# EAGLE design module-pam8320 (EAGLE 7.7.0)
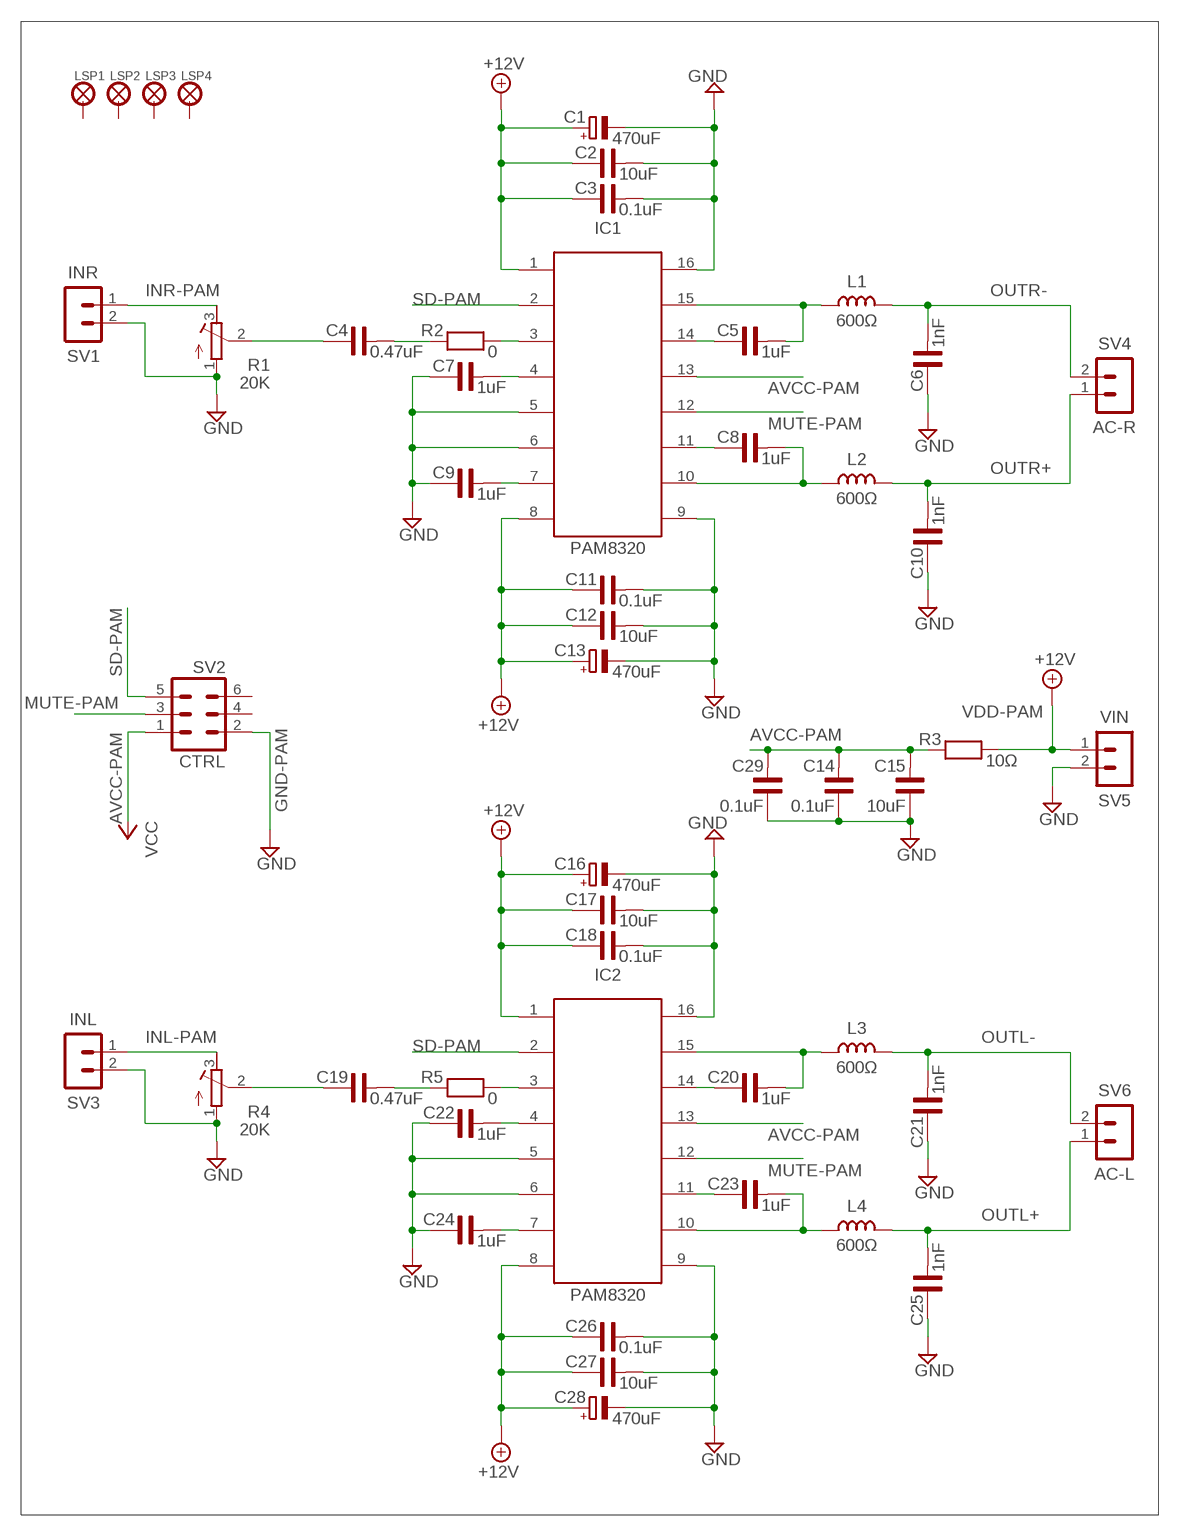
[diagram p0: schematic, sheet 1]

## Parts
C1  470uF  CPOL-EUE5-10.5  [E5-10,5]
C2  10uF  C-US1206  [C1206]
C3  0.1uF  C-US0805  [C0805]
C4  0.47uF  C-US0805  [C0805]
C5  1uF  C-US1206  [C1206]
C6  1nF  C-US0805  [C0805]
C7  1uF  C-US1206  [C1206]
C8  1uF  C-US1206  [C1206]
C9  1uF  C-US1206  [C1206]
C10  1nF  C-US0805  [C0805]
C11  0.1uF  C-US0805  [C0805]
C12  10uF  C-US1206  [C1206]
C13  470uF  CPOL-EUE5-10.5  [E5-10,5]
C14  0.1uF  C-US0805  [C0805]
C15  10uF  C-US1206  [C1206]
C16  470uF  CPOL-EUE5-10.5  [E5-10,5]
C17  10uF  C-US1206  [C1206]
C18  0.1uF  C-US0805  [C0805]
C19  0.47uF  C-US0805  [C0805]
C20  1uF  C-US1206  [C1206]
C21  1nF  C-US0805  [C0805]
C22  1uF  C-US1206  [C1206]
C23  1uF  C-US1206  [C1206]
C24  1uF  C-US1206  [C1206]
C25  1nF  C-US0805  [C0805]
C26  0.1uF  C-US0805  [C0805]
C27  10uF  C-US1206  [C1206]
C28  470uF  CPOL-EUE5-10.5  [E5-10,5]
C29  0.1uF  C-US0805  [C0805]
IC1  PAM8320  [SO16]
IC2  PAM8320  [SO16]
L1  600Ω  L-USL1206  [L1206]
L2  600Ω  L-USL1206  [L1206]
L3  600Ω  L-USL1206  [L1206]
L4  600Ω  L-USL1206  [L1206]
LSP1  LSP27  [LSP27]
LSP2  LSP27  [LSP27]
LSP3  LSP27  [LSP27]
LSP4  LSP27  [LSP27]
R1  20K  PV32H  [PV32H]
R2  0  R-US0805  [R0805]
R3  10Ω  R-US0805  [R0805]
R4  20K  PV32H  [PV32H]
R5  0  R-US0805  [R0805]
SV1  INR  MA02-1GREEN  [MA02-1-GREEN]
SV2  CTRL  MA03-2PL  [MA03-2]
SV3  INL  MA02-1GREEN  [MA02-1-GREEN]
SV4  AC-R  MA02-1GREEN  [MA02-1-GREEN]
SV5  VIN  MA02-1GREEN  [MA02-1-GREEN]
SV6  AC-L  MA02-1GREEN  [MA02-1-GREEN]

## Nets
AVCC-PAM: C14.2 C15.2 C29.2 IC1.13 IC2.13 R3.1 SV2.1 ; supply symbol labelled VCC
GND-PAM: C1.- C2.2 C3.2 C6.1 C7.1 C9.1 C10.1 C11.2 C12.2 C13.- C14.1 C15.1 C16.- C17.2 C18.2 C21.1 C22.1 C24.1 C25.1 C26.2 C27.2 C28.- C29.1 IC1.5 IC1.6 IC1.9 IC1.16 IC2.5 IC2.6 IC2.9 IC2.16 R1.1 R4.1 SV1.2 SV2.2 SV3.2 SV5.2 ; supply symbol labelled GND
INL-PAM: R4.3 SV3.1
INR-PAM: R1.3 SV1.1
MUTE-PAM: IC1.12 IC2.12 SV2.3
N$1: IC1.3 R2.2
N$2: C4.1 R1.2
N$3: C22.2 IC2.4
N$4: C4.2 R2.1
N$5: C24.2 IC2.7
N$6: C5.1 IC1.14
N$7: C7.2 IC1.4
N$8: C9.2 IC1.7
N$9: C5.2 IC1.15 L1.1
N$10: C8.1 IC1.11
N$11: C8.2 IC1.10 L2.1
N$13: C19.1 R4.2
N$24: IC2.3 R5.2
N$25: C19.2 R5.1
N$26: C20.1 IC2.14
N$28: C20.2 IC2.15 L3.1
N$29: C23.1 IC2.11
N$31: C23.2 IC2.10 L4.1
OUTL+: C25.2 L4.2 SV6.1
OUTL-: C21.2 L3.2 SV6.2
OUTR+: C10.2 L2.2 SV4.1
OUTR-: C6.2 L1.2 SV4.2
SD-PAM: IC1.2 IC2.2 SV2.5
VDD-PAM: C1.+ C2.1 C3.1 C11.1 C12.1 C13.+ C16.+ C17.1 C18.1 C26.1 C27.1 C28.+ IC1.1 IC1.8 IC2.1 IC2.8 R3.2 SV5.1 ; supply symbol labelled +12V
Unconnected: LSP1.MP LSP2.MP LSP3.MP LSP4.MP SV2.4 SV2.6

## Library data of the parts
C1 C13 C16 C28 = rcl:CPOL-EU: POLARIZED CAPACITOR, European symbol
C2 C5 C7-C9 C12 C15 C17 C20 C22-C24 C27 = MyComponents:C-US: SMD Multilayer Ceramic Capacitor
C3 C4 C6 C10 C11 C14 C18 C19 C21 C25 C26 C29 = MyComponents:C-US: SMD Multilayer Ceramic Capacitor; MOUSER: 80-C0805C104J5RAUTO
IC1 IC2 = MyComponents:PAM8320: PAM8320 20W Mono Class D Audio Amplifier
L1-L4 = MyComponents:L-US: SMD Ferrite Bead
LSP1-LSP4 = MyComponents:LSP27: Solder Pad, drill 2.75 mm
R1 R4 = MyComponents:PV32H: BOURNS Trimmer Potentiometers Lead Sealed Type Single-turn PV32 Series
R2 R3 R5 = MyComponents:R-US: SMD Resistor; MOUSER: 660-RK73H2ATTDD1R00F
SV1 SV3-SV6 = MyComponents:MA02-1: Headers & Wire Housing, 1 Row, 3 Position
SV2 = MyComponents:MA03-2: Headers & Wire Housing, 2 Row, 6 Position

## Board
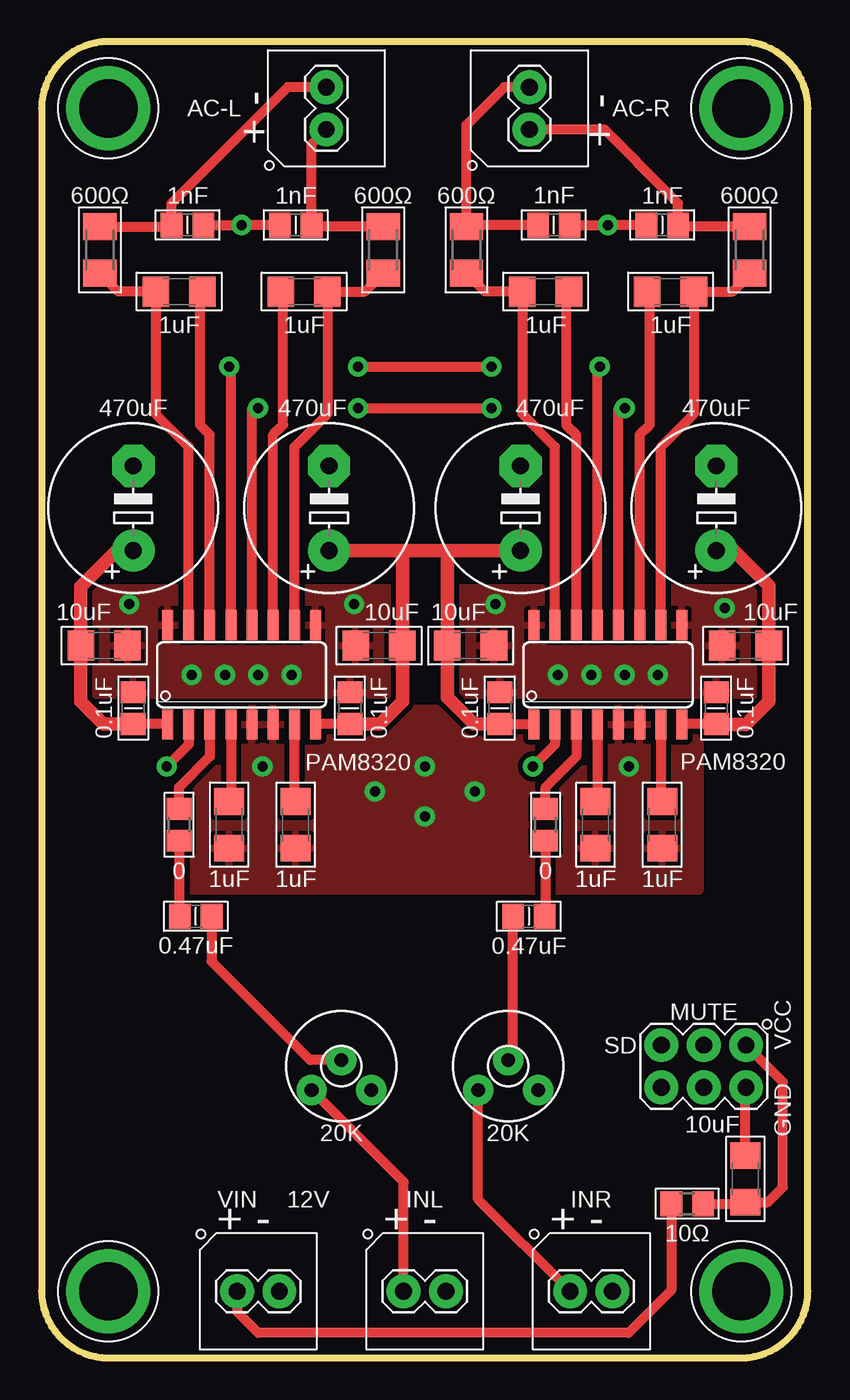
[diagram p1: board, top side]
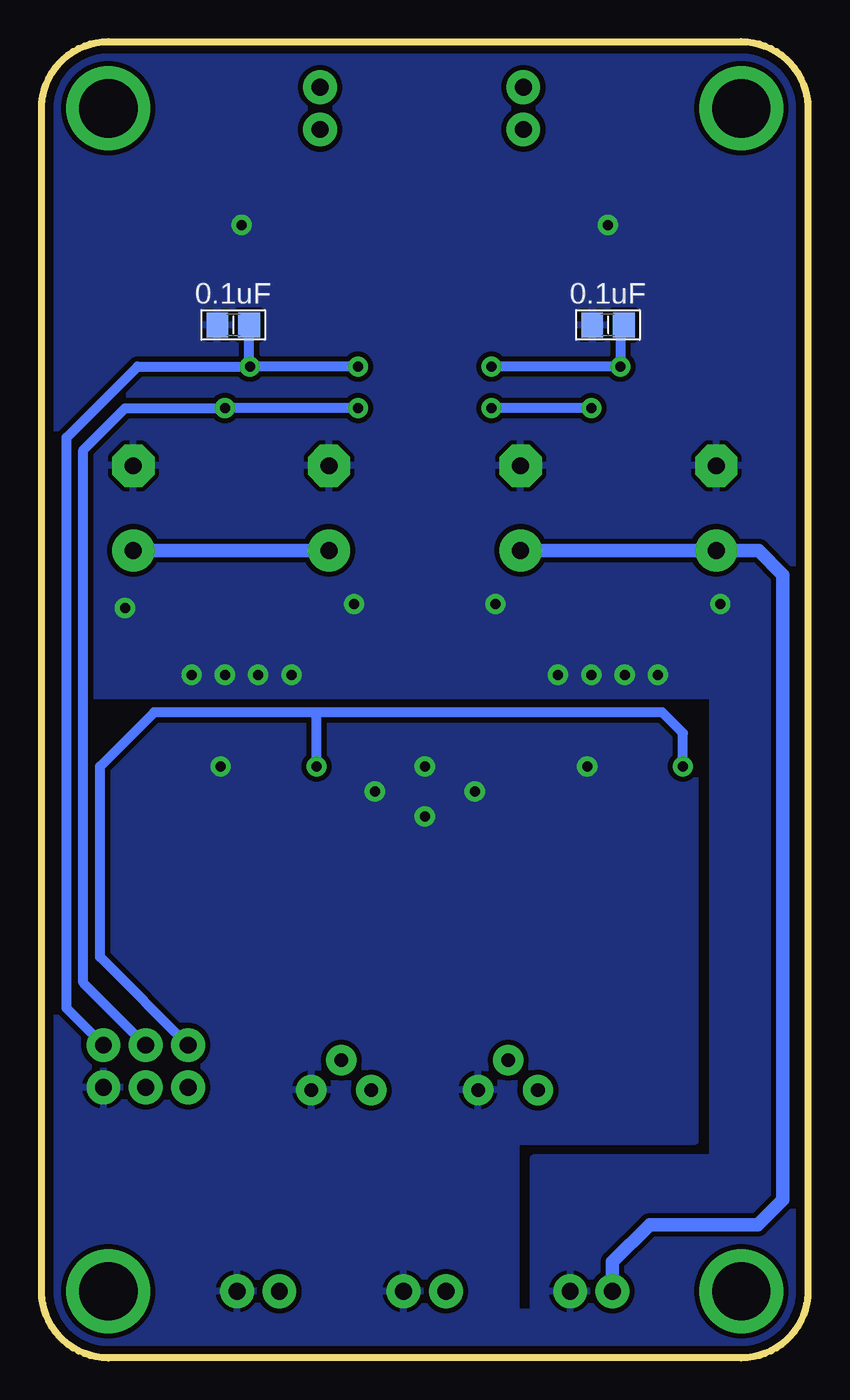
[diagram p2: board, bottom side, seen from below]

Size 46 x 79 mm. Coordinates in mm from the lower left corner, seen from the top.
Outline: 0,4 arc90 4,0 42,0 arc90 46,4 46,75 arc90 42,79 4,79 arc90 0,75 0,4
Copper layers (1*16): Top 0.035mm / dielectric 1.5mm / Bottom 0.035mm
Design rules "analog": minimum track width 15mil, minimum drill 19mil, track to track 12mil, track to pad 12mil, pad to pad 12mil, via to via 12mil, smd to smd 8mil, copper to edge 20mil, drill to drill 40mil, minimum pad ring 20mil, minimum via ring 12mil, stop-mask expansion 1mil, vias tented up to drill 0mil, thermal gap 10mil

### Footprints (pad centres in the part's own frame; a part is rotated, then mirrored left to right if it is on the bottom)
E5-10,5 = drill 1.016 pad 2.54: + -2.54,0 | drill 1.016 pad 2.54 octagon: - 2.54,0
C1206 = smd 1.6 x 1.8: 1 -1.4,0; 2 1.4,0
C0805 = smd 1.3 x 1.5: 1 -0.95,0; 2 0.95,0
SO16 = smd 0.66 x 1.8: 1 -4.445,-2.973; 2 -3.175,-2.973; 3 -1.905,-2.973; 4 -0.635,-2.973; 5 0.635,-2.973; 6 1.905,-2.973; 7 3.175,-2.973; 8 4.445,-2.973; 9 4.445,2.973; 10 3.175,2.973; 11 1.905,2.973; 12 0.635,2.973; 13 -0.635,2.973; 14 -1.905,2.973; 15 -3.175,2.973; 16 -4.445,2.973
L1206 = smd 1.6 x 2: 1 -1.4,0; 2 1.4,0
LSP27 = drill 3.5 pad 5: MP 0,0
PV32H = drill 0.813: 1 1.798,-1.422; 2 0,0.374; 3 -1.794,-1.422
R0805 = smd 1.3 x 1.5: 1 -0.95,0; 2 0.95,0
MA02-1-GREEN = drill 1.016: 1 -1.27,0; 2 1.27,0
MA03-2 = drill 1.016: 1 -2.54,-1.27; 2 -2.54,1.27; 3 0,-1.27; 4 0,1.27; 5 2.54,-1.27; 6 2.54,1.27

### Placement (x,y rotation side)
C1  28.75,51 90 top
C2  42.25,42.75 180 top
C3  18.5,39 90 top
C4  29.25,26.5 0 top
C5  30.25,64 180 top
C6  30.75,68 180 top
C7  33.25,32 90 top
C8  37.75,64 0 top
C9  37.25,32 90 top
C10  37.25,68 0 top
C11  5.5,39 90 top
C12  20.25,42.75 180 top
C13  40.5,51 90 top
C14  12,62 0 bottom
C15  42.25,10.75 270 top
C16  5.5,51 90 top
C17  3.75,42.75 0 top
C18  27.5,39 90 top
C19  9.25,26.5 180 top
C20  8.25,64 180 top
C21  8.75,68 180 top
C22  11.25,32 90 top
C23  15.75,64 0 top
C24  15.25,32 90 top
C25  15.25,68 0 top
C26  40.5,39 90 top
C27  25.75,42.75 0 top
C28  17.25,51 90 top
C29  34.5,62 0 bottom
IC1  34,41 0 top
IC2  12,41 0 top
L1  25.5,66.5 90 top
L2  42.5,66.5 90 top
L3  3.5,66.5 90 top
L4  20.5,66.5 90 top
LSP1  4,75 0 top
LSP2  42,75 0 top
LSP3  42,4 0 top
LSP4  4,4 0 top
R1  28,17.5 0 top
R2  30.25,32 90 top
R3  38.75,9.25 180 top
R4  18,17.5 0 top
R5  8.25,32 90 top
SV1  33,4 0 top
SV2  39.75,17.5 180 top
SV3  23,4 0 top
SV4  29.28,75 90 top
SV5  13,4 0 top
SV6  17.09,75 90 top

### Tracks (layer width: path | path; a pad name or v marks a point on that pad's centre or on a via)
AVCC-PAM  (via drill 0.6)
  Top 0.61: IC1.13 33.37,59.5 v33.5,59.5 | v19,59.5 v27,59.5 | IC2.13 11.37,59.38 v11.25,59.5 | R3.1 42.15,9.25 C15.2 43.6,9.35 44.5,10.25 44.5,16.56 SV2.1
  Bottom 0.61: v33.5,59.5 33.55,59.55 C29.2 | v27,59.5 v33.5,59.5 | C14.2 11.25,61.8 v11.25,59.5 v19,59.5 | v33.5,59.5 40.25,59.5 44.5,55.25 44.5,20.98 SV2.1
GND-PAM  (via drill 0.6)
  Top 0.61: C21.1 v12,68 C25.1 | C6.1 v34,68 C10.1 | C15.1 42.25,16.19 SV2.2
  other vias: 9,41 11,41 13,41 15,41 33,41 35,41 37,41 31,41 13.25,35.5 35.25,35.5 23,35.5 5.25,45.25 18.75,45.25 27.25,45.25 41,45 20,34 26,34 23,32.5
  pour Top: 0.5,46.25 44.5,46.25 45,39.75 1,39.75
  pour Top: 9,39 39.5,39 39.5,28 9,28
  pour Bottom: 0,0 0,79 46,79 46,39.75 5.75,39.75 5.75,12 16.5,12 16.5,0
  pour Bottom: 46,0 13,0 12.75,2.75 17.5,2.75 17.5,13 6.75,13 6.75,38.75 46,38.75
INL-PAM
  Top 0.61: SV3.1 21.73,10.55 R4.3
INR-PAM
  Top 0.61: SV1.1 26.21,9.52 R1.3
MUTE-PAM  (via drill 0.6)
  Top 0.61: IC2.12 12.63,57 v13,57 | IC1.12 34.63,57 v35,57 | v19,57 v27,57
  Bottom 0.61: v13,57 v19,57 | v27,57 v35,57 41,57 43.5,54.5 43.5,22.52 SV2.3
N$1
  Top 0.61: IC1.3 32.09,36.09 30.25,34.25 R2.2
N$2
  Top 0.61: R1.2 28.3,18.17 C4.1
N$3
  Top 0.61: IC2.4 11.37,33.52 C22.2
N$4
  Top 0.61: R2.1 30.25,26.55 C4.2
N$5
  Top 0.61: C24.2 15.18,33.4 IC2.7
N$6
  Top 0.61: IC1.14 32.09,55.41 31.5,56 31.5,63.85 C5.1
N$7
  Top 0.61: IC1.4 33.37,33.4 C7.2
N$8
  Top 0.61: IC1.7 37.17,33.4 C9.2
N$9
  Top 0.61: IC1.15 30.82,54.67 28.85,56.65 C5.2 26.6,64 L1.1
N$10
  Top 0.61: IC1.11 35.91,55.41 36.5,56 36.5,63.85 C8.1
N$11
  Top 0.61: IC1.10 37.17,54.67 39.15,56.65 C8.2 41.5,64 43,65.5 42.9,65.5 L2.1
N$13
  Top 0.61: C19.1 10.2,23.8 16.13,17.87 R4.2
N$24
  Top 0.61: IC2.3 10.1,36.09 8.25,34.25 R5.2
N$25
  Top 0.61: R5.1 8.25,26.55 C19.2
N$26
  Top 0.61: IC2.14 10.1,55.41 9.5,56 9.5,62.85 C20.1
N$28
  Top 0.61: IC2.15 8.82,54.67 6.85,56.65 C20.2 4.6,64 L3.1
N$29
  Top 0.61: IC2.11 13.9,55.41 14.5,56 14.5,63.85 C23.1
N$31
  Top 0.61: IC2.10 15.18,54.67 17.15,56.65 C23.2 19.4,64 L4.1
OUTL+
  Top 0.61: L4.2 16.05,67.9 C25.2 16.2,72.84 SV6.1
OUTL-
  Top 0.61: L3.2 7.95,67.9 C21.2 7.8,69.3 14.77,76.27 SV6.2
OUTR+
  Top 0.61: L2.2 38.05,67.9 C10.2 38.2,69.3 37.95,69.55 37.75,69.75 33.77,73.73 SV4.1
OUTR-
  Top 0.61: 29.95,67.9 C6.2 26,68 25.5,68.5 | L1.2 25.5,68.5 | 25.5,68.5 25.5,74 27.77,76.27 SV4.2
SD-PAM  (via drill 0.6)
  Top 0.61: IC2.2 8.82,36.83 v7.5,35.5 | IC1.2 30.82,36.83 v29.5,35.5
  Bottom 0.61: v7.5,35.5 7.5,37.5 8.75,38.75 29.5,38.75 | 29.5,38.75 39.25,38.75 42.5,35.5 42.5,24.06 SV2.5 | v29.5,35.5 29.5,38.75
VDD-PAM
  Top 0.61: 29.55,38 IC1.1 29.53,38.05 C18.1 | IC2.1 7.53,38.05 C11.1 5.45,38.1 | C3.1 16.47,38.05 IC2.8 | C26.1 38.47,38.05 IC1.8 | R3.2 37.8,4.05 35.25,1.5 13,1.5 11.75,2.75 11.75,3.98 SV5.1
  Top 0.813: C26.1 41.02,38.03 42.28,38.03 43.65,39.4 C2.1 43.65,46.35 41.54,48.46 C13.+ | C11.1 3.7,38.05 2.35,39.4 C17.1 2.35,46.31 4.5,48.46 C16.+ | C3.1 20.3,38.05 21.65,39.4 C12.1 21.65,48.31 21.5,48.46 | C18.1 25.95,38.05 24.35,39.65 C27.1 24.35,48.31 24.5,48.46 | C28.+ 21.5,48.46 | 21.5,48.46 24.5,48.46 | 24.5,48.46 C1.+
  Bottom 0.813: C28.+ C16.+ 2.96,48.46 1.5,47 1.5,9.5 3,8 9.5,8 11.73,5.77 SV5.1 | C1.+ C13.+

### Text on the board
tPlace: + - | + - | + - | + - | + -
tNames: MUTE | SD | VCC | GND | 12V